# EAGLE design microsd-legs (EAGLE 6.5.0)
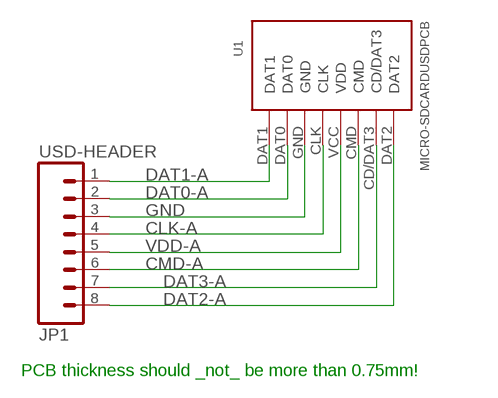
[diagram p0: schematic, sheet 1]

## Parts
JP1  USD-HEADER  M08LOCK  [1X08_LOCK]
U1  MICRO-SDCARDUSDPCB  [MICRO-SDCARD]

## Nets
CLK-A: JP1.4 U1.CLK
CMD-A: JP1.6 U1.CMD
DAT0-A: JP1.2 U1.DAT0
DAT1-A: JP1.1 U1.DAT1
DAT2-A: JP1.8 U1.DAT2
DAT3-A: JP1.7 U1.CD/DAT3
GND: JP1.3 U1.GND
VDD-A: JP1.5 U1.VCC(VDD)

## Notes on the sheet
- PCB thickness should _not_ be more than 0.75mm!

## Library data of the parts
JP1 = SparkFun:M08: Header 8 Standard 8-pin 0.1" header. Use with straight break away headers (SKU : PRT-00116), right angle break away headers (PRT-00553), swiss pins (PRT-00743), machine pins (PRT-00117), and female headers (PRT-00115).
U1 = joels-parts:MICRO-SDCARD: MicroSD card PCB adapter, to be used for Joel's switch.

## Board
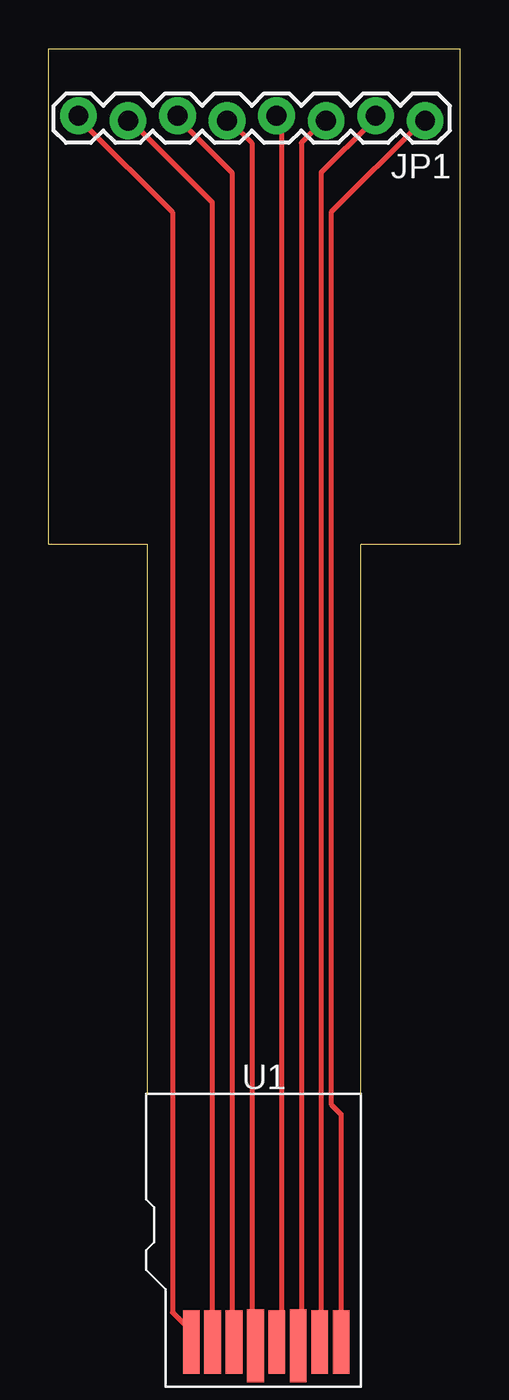
[diagram p1: board, top side]

Size 21.08 x 53.59 mm. Coordinates in mm from the lower left corner, seen from the top.
Outline: 5.08,0 5.08,28.19 0,28.19 0,53.59 21.08,53.59 21.08,28.19 16,28.19 16,0
Copper layers (1*16): Top 0.035mm / dielectric 1.5mm / Bottom 0.035mm
Design rules "default *": minimum track width 6mil, minimum drill 13mil, track to track 8mil, track to pad 8mil, pad to pad 8mil, via to via 8mil, smd to smd 8mil, copper to edge 6mil, drill to drill 20mil, minimum pad ring 10mil, minimum via ring 8mil, stop-mask expansion 4mil, vias tented up to drill 0mil, thermal gap 10mil

### Footprints (pad centres in the part's own frame; a part is rotated, then mirrored left to right if it is on the bottom)
1X08_LOCK = drill 1.016 pad 1.88: 1 0,0.127; 2 2.54,-0.127; 3 5.08,0.127; 4 7.62,-0.127; 5 10.16,0.127; 6 12.7,-0.127; 7 15.24,0.127; 8 17.78,-0.127
MICRO-SDCARD = smd 0.85 x 3.25: CD/DAT3 2.56,2.3; CLK 5.86,2.3; CMD 3.66,2.3; DAT0 8.06,2.3; DAT1 9.16,2.3; DAT2 1.46,2.3 | smd 0.85 x 3.75: GND 6.96,2.1; VCC 4.76,2.1

### Placement (x,y rotation side)
JP1  19.3,50.04 180 top
U1  5.84,-14.99 0 top  (outside the outline)

### Tracks (layer width: path | path; a pad name or v marks a point on that pad's centre or on a via)
CLK-A
  Top 0.254: U1.CLK 11.94,-12.19 11.94,49.78 JP1.4
CMD-A
  Top 0.254: U1.CMD 9.4,-12.19 9.4,47.24 6.86,49.78 JP1.6
DAT0-A
  Top 0.254: U1.DAT0 13.97,-12.19 13.97,47.24 16.51,49.78 JP1.2
DAT1-A
  Top 0.254: U1.DAT1 14.99,-12.19 14.99,-1.02 14.48,-0.51 14.48,45.21 19.05,49.78 JP1.1
DAT2-A
  Top 0.254: U1.DAT2 7.37,-12.19 6.35,-11.18 6.35,45.21 1.78,49.78 JP1.8
DAT3-A
  Top 0.254: U1.CD/DAT3 8.38,-12.19 8.38,45.72 4.32,49.78 JP1.7
GND
  Top 0.254: U1.GND 12.95,-12.7 12.95,48.77 13.97,49.78 JP1.3
VDD-A
  Top 0.254: U1.VCC 10.41,-12.7 10.41,48.77 9.4,49.78 JP1.5